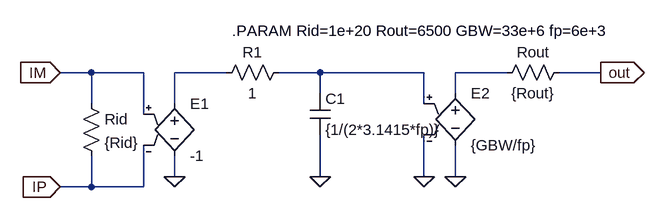
[diagram p0: schematic ao_model.asc]
ao_model.asc, the LTspice schematic file:
Version 4
SHEET 1 880 852
WIRE -80 352 -128 352
WIRE 0 352 -80 352
WIRE 128 352 48 352
WIRE 272 352 208 352
WIRE 432 352 272 352
WIRE 560 352 480 352
WIRE 704 352 640 352
WIRE 272 384 272 352
WIRE 480 384 480 352
WIRE -80 400 -80 352
WIRE 48 400 48 352
WIRE 432 400 432 352
WIRE 0 416 0 352
WIRE 48 512 48 480
WIRE 272 512 272 448
WIRE 432 512 432 448
WIRE 480 512 480 464
WIRE -80 528 -80 480
WIRE -80 528 -128 528
WIRE 0 528 0 464
WIRE 0 528 -80 528
FLAG -128 352 IM
IOPIN -128 352 In
FLAG -128 528 IP
IOPIN -128 528 In
FLAG 48 512 0
FLAG 272 512 0
FLAG 432 512 0
FLAG 480 512 0
FLAG 704 352 out
IOPIN 704 352 Out
SYMBOL e 48 384 R0
SYMATTR InstName E1
SYMATTR Value -1
SYMBOL res 224 336 R90
WINDOW 0 0 56 VBottom 2
WINDOW 3 32 56 VTop 2
SYMATTR InstName R1
SYMATTR Value 1
SYMBOL res -96 384 R0
SYMATTR InstName Rid
SYMATTR Value {Rid}
SYMBOL cap 256 384 R0
SYMATTR InstName C1
SYMATTR Value {1/(2*3.1415*fp)}
SYMBOL e 480 368 R0
SYMATTR InstName E2
SYMATTR Value {GBW/fp}
SYMBOL res 656 336 R90
WINDOW 0 0 56 VBottom 2
WINDOW 3 32 56 VTop 2
SYMATTR InstName Rout
SYMATTR Value {Rout}
TEXT 136 288 Left 2 !.PARAM Rid=1e+20 Rout=6500 GBW=33e+6 fp=6e+3

The netlist it stands for:
* ao_model.asc
E1 N001 0 IM IP -1
R1 N002 N001 1
Rid IM IP {Rid}
C1 N002 0 {1/(2*3.1415*fp)}
E2 N003 0 N002 0 {GBW/fp}
Rout out N003 {Rout}
.PARAM Rid=1e+20 Rout=6500 GBW=33e+6 fp=6e+3
.backanno
.end